# EAGLE design Radial-V Bus (EAGLE 7.4.0)
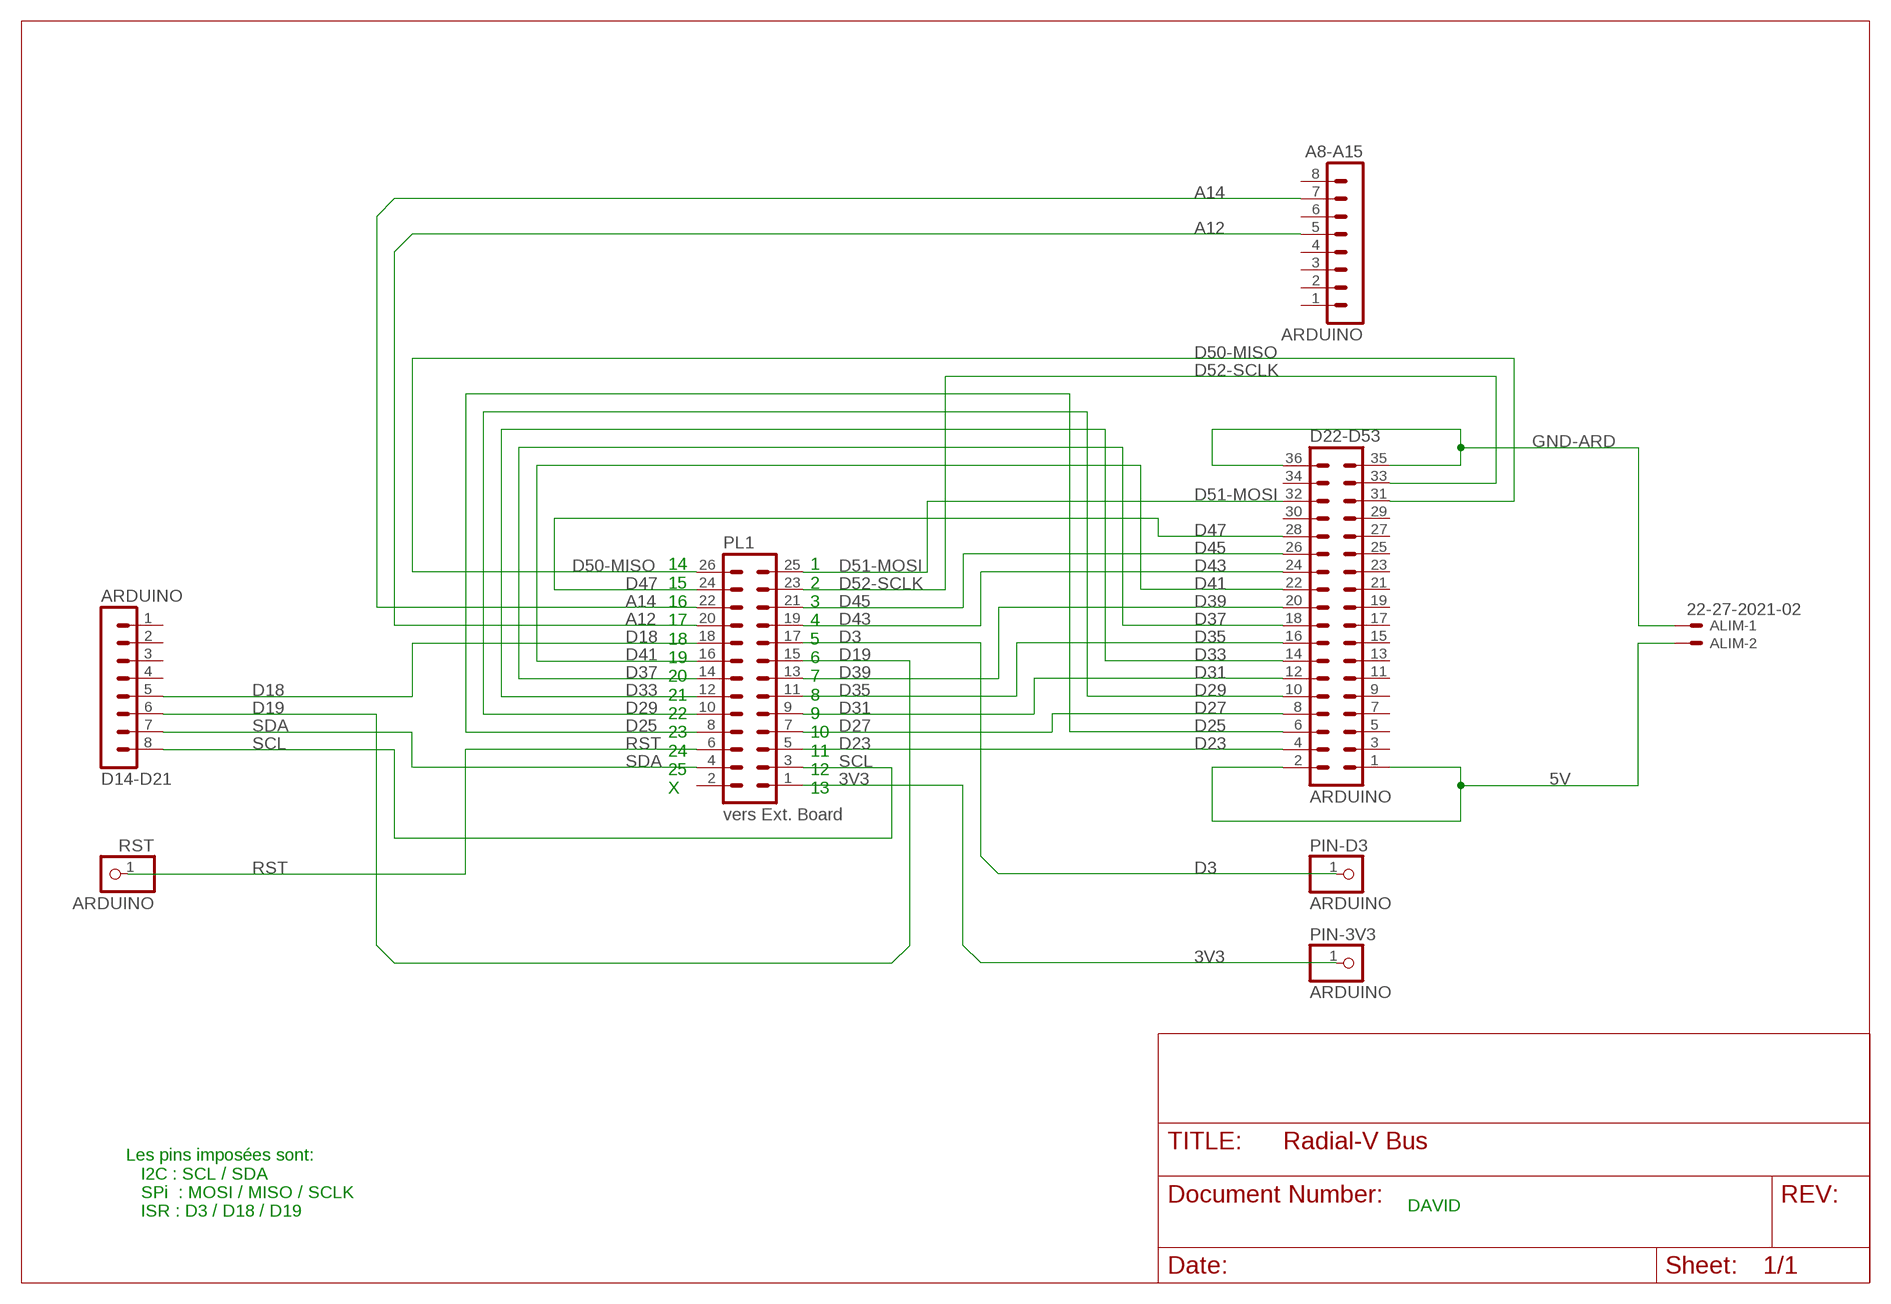
[diagram p0: schematic, sheet 1]

## Parts
A8-A15  ARDUINO  MA08-1  [MA08-1]
ALIM  22-27-2021-02  [6410-02]
D14-D21  ARDUINO  MA08-1  [MA08-1]
D22-D53  ARDUINO  MA18-2  [MA18-2]
PIN-3V3  ARDUINO  PINHD-1X1  [1X01]
PIN-D3  ARDUINO  PINHD-1X1  [1X01]
PL1  vers Ext. Board  26H  [26H]
RST  ARDUINO  PINHD-1X1  [1X01]

## Nets
3V3: PIN-3V3.1 PL1.1
5V: ALIM.2 D22-D53.1 D22-D53.2
A12: A8-A15.5 PL1.20
A14: A8-A15.7 PL1.22
D3: PIN-D3.1 PL1.17
D18: D14-D21.5 PL1.18
D19: D14-D21.6 PL1.15
D23: D22-D53.4 PL1.5
D25: D22-D53.6 PL1.8
D27: D22-D53.8 PL1.7
D29: D22-D53.10 PL1.10
D31: D22-D53.12 PL1.9
D33: D22-D53.14 PL1.12
D35: D22-D53.16 PL1.11
D37: D22-D53.18 PL1.14
D39: D22-D53.20 PL1.13
D41: D22-D53.22 PL1.16
D43: D22-D53.24 PL1.19
D45: D22-D53.26 PL1.21
D47: D22-D53.28 PL1.24
D50-MISO: D22-D53.31 PL1.26
D51-MOSI: D22-D53.32 PL1.25
D52-SCLK: D22-D53.33 PL1.23
GND-ARD: ALIM.1 D22-D53.35 D22-D53.36
RST: PL1.6 RST.1
SCL: D14-D21.8 PL1.3
SDA: D14-D21.7 PL1.4
Unconnected: A8-A15.1 A8-A15.2 A8-A15.3 A8-A15.4 A8-A15.6 A8-A15.8 D14-D21.1 D14-D21.2 D14-D21.3 D14-D21.4 D22-D53.3 D22-D53.5 D22-D53.7 D22-D53.9 D22-D53.11 D22-D53.13 D22-D53.15 D22-D53.17 D22-D53.19 D22-D53.21 D22-D53.23 D22-D53.25 D22-D53.27 D22-D53.29 D22-D53.30 D22-D53.34 PL1.2

## Notes on the sheet
- 14
  15
  16
  17
  18
  19
  20
  21
  22
  23
  24
  25
  X
- 1
  2
  3
  4
  5
  6
  7
  8
  9
  10
  11
  12
  13
- DAVID
- Les pins imposées sont:
     I2C : SCL / SDA
     SPi  : MOSI / MISO / SCLK
     ISR : D3 / D18 / D19

## Library data of the parts
A8-A15 D14-D21 = con-lstb:MA08-1: PIN HEADER; OC_FARNELL: unknown; OC_NEWARK: unknown
ALIM = con-molex:22-?-02: CONNECTOR wire to board 2.54 mm (.1 inch) pitch header; OC_FARNELL: unknown; OC_NEWARK: unknown
D22-D53 = con-lstb:MA18-2: PIN HEADER; OC_FARNELL: unknown; OC_NEWARK: unknown
PIN-3V3 PIN-D3 RST = pinhead:PINHD-1X1: PIN HEADER
PL1 = con-harting-h:26H: CONNECTOR; OC_FARNELL: unknown; OC_NEWARK: unknown

## Board
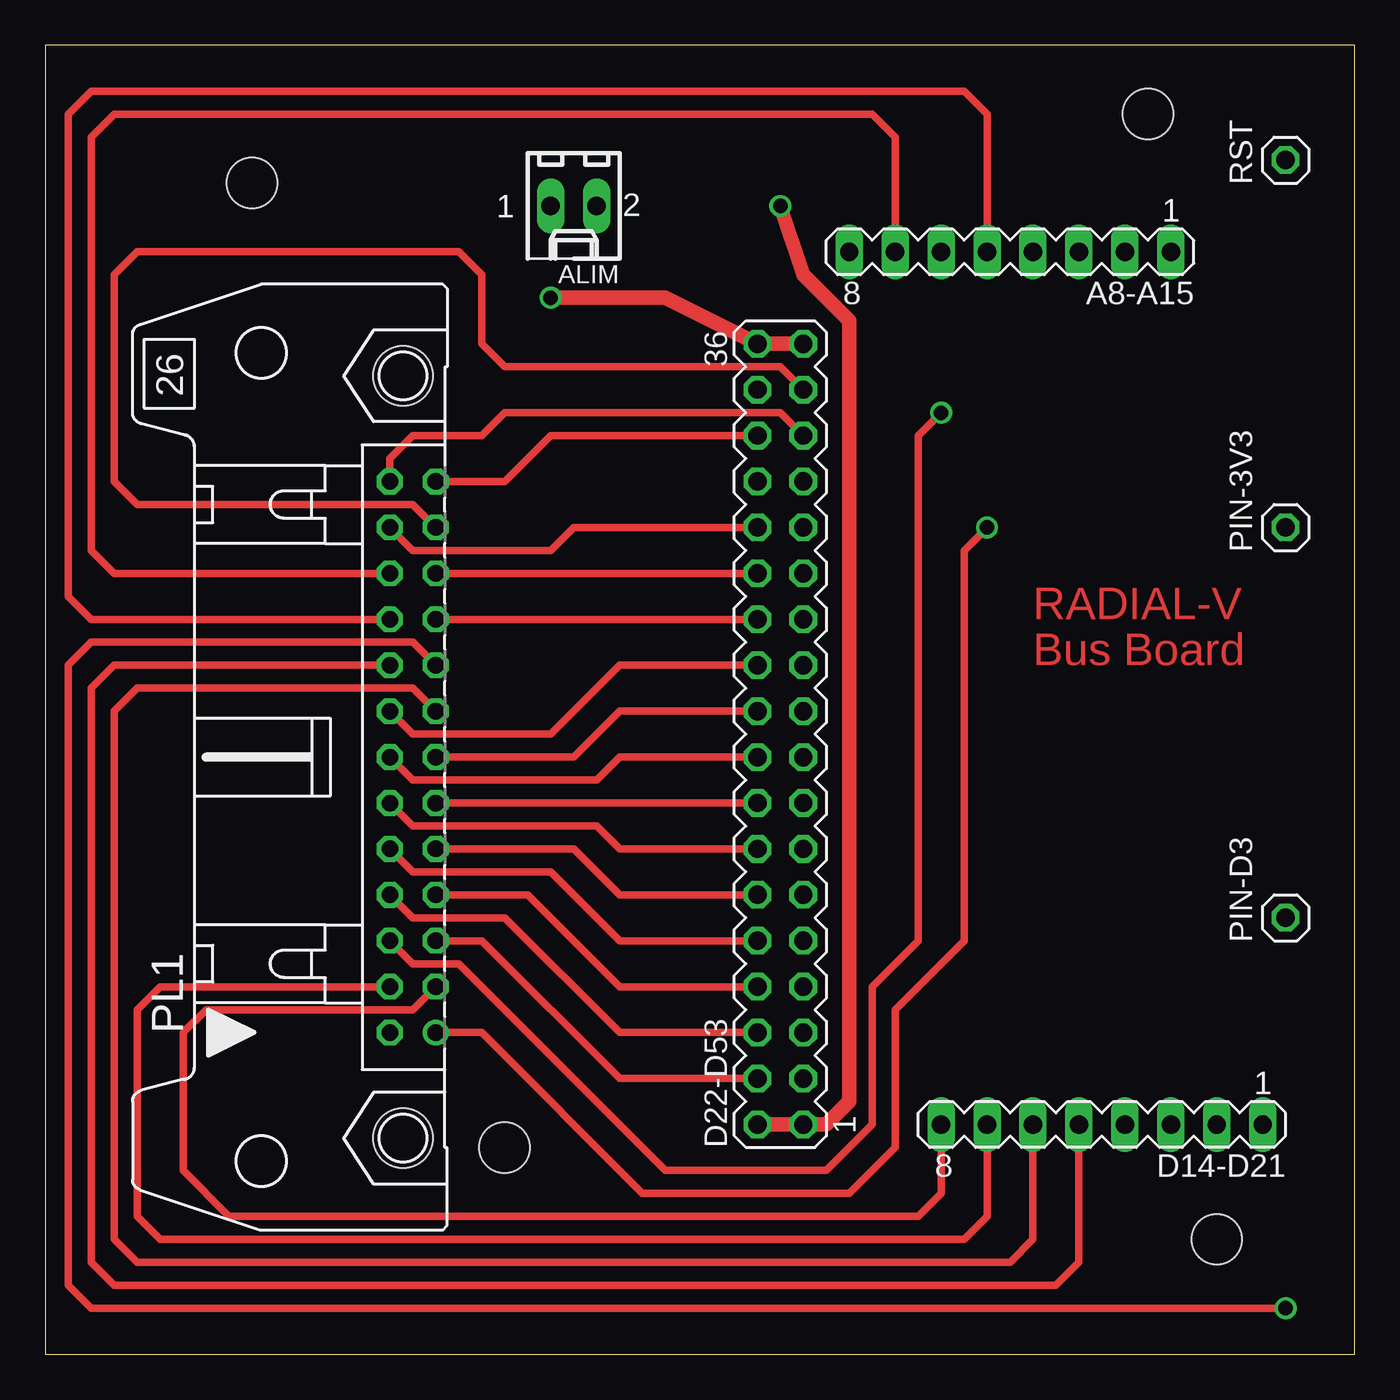
[diagram p1: board, top side]
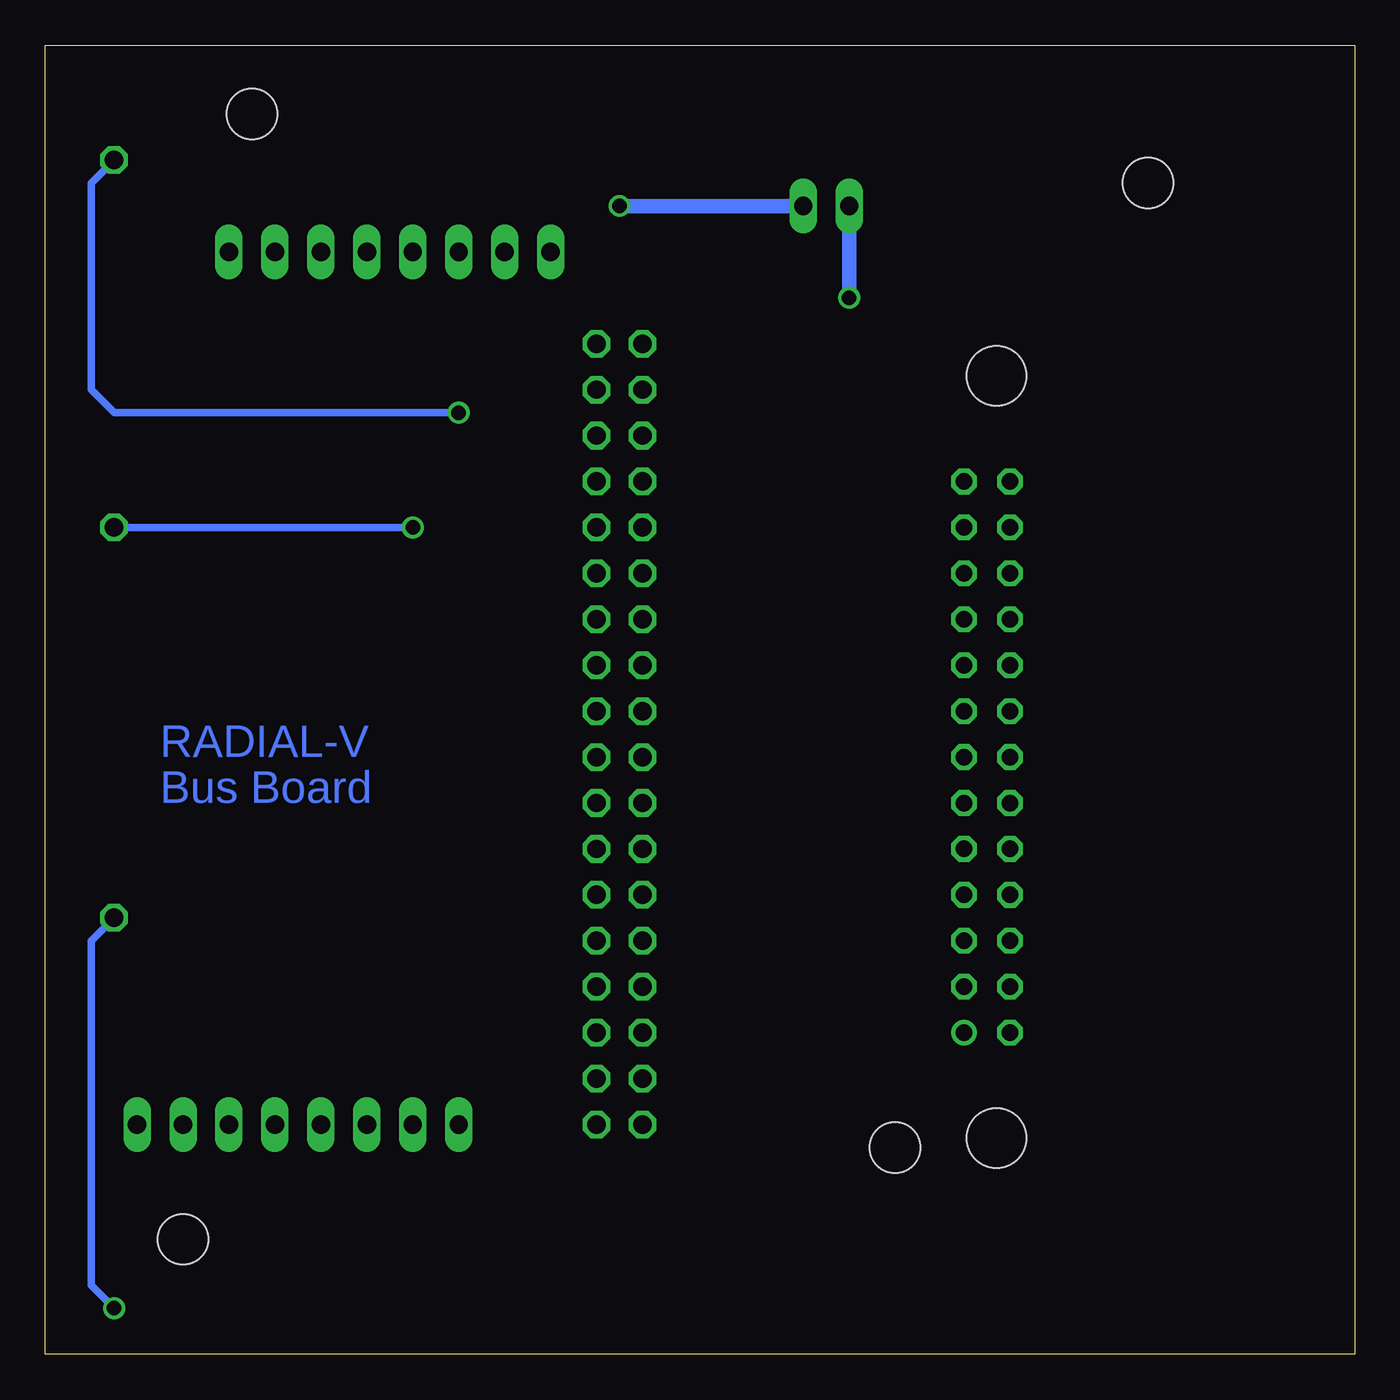
[diagram p2: board, bottom side, seen from below]

Size 72.39 x 72.4 mm. Coordinates in mm from the lower left corner, seen from the top.
Outline: 0,0.01 23.8,0.01 30.15,0 72.39,0.01 72.39,72.39 71.12,72.4 0,72.39 0,0.01
Copper layers (1*16): Top 0.035mm / dielectric 1.5mm / Bottom 0.035mm
Design rules "default": minimum track width 10mil, minimum drill 24mil, track to track 8mil, track to pad 8mil, pad to pad 8mil, via to via 8mil, smd to smd 8mil, copper to edge 40mil, drill to drill 8mil, minimum pad ring 10mil, minimum via ring 8mil, stop-mask expansion 4mil, vias tented up to drill 0mil, thermal gap 10mil
Holes 2.8 mm at 60.96,68.59 64.77,6.36 25.4,11.44 11.43,64.78

### Footprints (pad centres in the part's own frame; a part is rotated, then mirrored left to right if it is on the bottom)
MA08-1 = drill 1.016 long: 1 -8.89,0; 2 -6.35,0; 3 -3.81,0; 4 -1.27,0; 5 1.27,0; 6 3.81,0; 7 6.35,0; 8 8.89,0
6410-02 = drill 1.016 long: 1 1.27,0; 2 -1.27,0
MA18-2 = drill 1.016 octagon: 1 -21.59,-1.27; 2 -21.59,1.27; 3 -19.05,-1.27; 4 -19.05,1.27; 5 -16.51,-1.27; 6 -16.51,1.27; 7 -13.97,-1.27; 8 -13.97,1.27; 9 -11.43,-1.27; 10 -11.43,1.27; 11 -8.89,-1.27; 12 -8.89,1.27; 13 -6.35,-1.27; 14 -6.35,1.27; 15 -3.81,-1.27; 16 -3.81,1.27; 17 -1.27,-1.27; 18 -1.27,1.27; 19 1.27,-1.27; 20 1.27,1.27; 21 3.81,-1.27; 22 3.81,1.27; 23 6.35,-1.27; 24 6.35,1.27; 25 8.89,-1.27; 26 8.89,1.27; 27 11.43,-1.27; 28 11.43,1.27; 29 13.97,-1.27; 30 13.97,1.27; 31 16.51,-1.27; 32 16.51,1.27; 33 19.05,-1.27; 34 19.05,1.27; 35 21.59,-1.27; 36 21.59,1.27
1X01 = drill 1.016 octagon: 1 0,0
26H = drill 0.914: 1 -15.24,-1.27 | drill 0.914 octagon: 2 -15.24,1.27; 3 -12.7,-1.27; 4 -12.7,1.27; 5 -10.16,-1.27; 6 -10.16,1.27; 7 -7.62,-1.27; 8 -7.62,1.27; 9 -5.08,-1.27; 10 -5.08,1.27; 11 -2.54,-1.27; 12 -2.54,1.27; 13 0,-1.27; 14 0,1.27; 15 2.54,-1.27; 16 2.54,1.27; 17 5.08,-1.27; 18 5.08,1.27; 19 7.62,-1.27; 20 7.62,1.27; 21 10.16,-1.27; 22 10.16,1.27; 23 12.7,-1.27; 24 12.7,1.27; 25 15.24,-1.27; 26 15.24,1.27 | hole 3.302: -21.082,0.533; 21.082,0.533

### Placement (x,y rotation side)
A8-A15  53.34,60.97 180 top
ALIM  29.21,63.51 180 top
D14-D21  58.42,12.71 180 top
D22-D53  40.64,34.3 90 top
PIN-3V3  68.58,45.73 90 top
PIN-D3  68.58,24.14 90 top
PL1  20.32,33.03 90 top
RST  68.58,66.05 90 top

### Tracks (layer width: path | path; a pad name or v marks a point on that pad's centre or on a via)
3V3  (via drill 0.8)
  Top 0.406: v52.07,45.73 50.8,44.46 50.8,22.87 46.99,19.06 46.99,11.44 44.45,8.9 33.02,8.9 24.13,17.79 PL1.1
  Bottom 0.406: v52.07,45.73 PIN-3V3.1
5V  (via drill 0.8)
  Top 0.813: D22-D53.2 D22-D53.1 43.18,12.71 44.45,13.98 44.45,57.16 41.91,59.7 v40.64,63.51
  Bottom 0.813: ALIM.2 v40.64,63.51
A12
  Top 0.406: A8-A15.5 52.07,68.59 50.8,69.86 2.54,69.86 1.27,68.59 1.27,41.92 2.54,40.65 PL1.20
A14
  Top 0.406: A8-A15.7 46.99,67.32 45.72,68.59 3.81,68.59 2.54,67.32 2.54,44.46 3.81,43.19 PL1.22
D3  (via drill 0.8)
  Top 0.406: v68.58,2.55 2.54,2.55 1.27,3.82 1.27,38.11 2.54,39.38 20.32,39.38 PL1.17
  Bottom 0.406: v68.58,2.55 69.85,3.82 69.85,22.87 PIN-D3.1
D18
  Top 0.406: D14-D21.5 57.15,5.09 55.88,3.82 3.81,3.82 2.54,5.09 2.54,36.84 3.81,38.11 PL1.18
D19
  Top 0.406: D14-D21.6 54.61,6.36 53.34,5.09 5.08,5.09 3.81,6.36 3.81,35.57 5.08,36.84 20.32,36.84 PL1.15
D23
  Top 0.406: D22-D53.4 31.75,15.25 24.13,22.87 PL1.5
D25
  Top 0.406: D22-D53.6 31.75,17.79 25.4,24.14 20.32,24.14 PL1.8
D27
  Top 0.406: D22-D53.8 31.75,20.33 26.67,25.41 PL1.7
D29
  Top 0.406: D22-D53.10 31.75,22.87 27.94,26.68 20.32,26.68 PL1.10
D31
  Top 0.406: D22-D53.12 31.75,25.41 29.21,27.95 PL1.9
D33
  Top 0.406: D22-D53.14 31.75,27.95 30.48,29.22 20.32,29.22 PL1.12
D35
  Top 0.406: D22-D53.16 PL1.11
D37
  Top 0.406: D22-D53.18 31.75,33.03 30.48,31.76 20.32,31.76 PL1.14
D39
  Top 0.406: D22-D53.20 31.75,35.57 29.21,33.03 PL1.13
D41
  Top 0.406: D22-D53.22 31.75,38.11 27.94,34.3 20.32,34.3 PL1.16
D43
  Top 0.406: D22-D53.24 PL1.19
D45
  Top 0.406: D22-D53.26 PL1.21
D47
  Top 0.406: D22-D53.28 29.21,45.73 27.94,44.46 20.32,44.46 PL1.24
D50-MISO
  Top 0.406: D22-D53.31 40.64,52.08 25.4,52.08 24.13,50.81 20.32,50.81 19.05,49.54 PL1.26
D51-MOSI
  Top 0.406: D22-D53.32 27.94,50.81 25.4,48.27 PL1.25
D52-SCLK
  Top 0.406: D22-D53.33 40.64,54.62 25.4,54.62 24.13,55.89 24.13,59.7 22.86,60.97 5.08,60.97 3.81,59.7 3.81,48.27 5.08,47 20.32,47 PL1.23
GND-ARD  (via drill 0.8)
  Top 0.813: v27.94,58.43 34.29,58.43 D22-D53.36 D22-D53.35
  Bottom 0.813: ALIM.1 v27.94,58.43
RST  (via drill 0.8)
  Top 0.406: PL1.6 20.32,21.6 22.86,21.6 34.29,10.17 43.18,10.17 45.72,12.71 45.72,20.33 48.26,22.87 48.26,50.81 v49.53,52.08
  Bottom 0.406: v49.53,52.08 68.58,52.08 69.85,53.35 69.85,64.78 RST.1
SCL
  Top 0.406: D14-D21.8 49.53,8.9 48.26,7.63 10.16,7.63 7.62,10.17 7.62,17.79 8.89,19.06 20.32,19.06 PL1.3
SDA
  Top 0.406: D14-D21.7 52.07,7.63 50.8,6.36 6.35,6.36 5.08,7.63 5.08,19.06 6.35,20.33 PL1.4

### Text on the board
Top: RADIAL-V | Bus Board
Bottom: RADIAL-V | Bus Board